# EAGLE schematic arm7-oscilloscope (EAGLE 7.3.0)
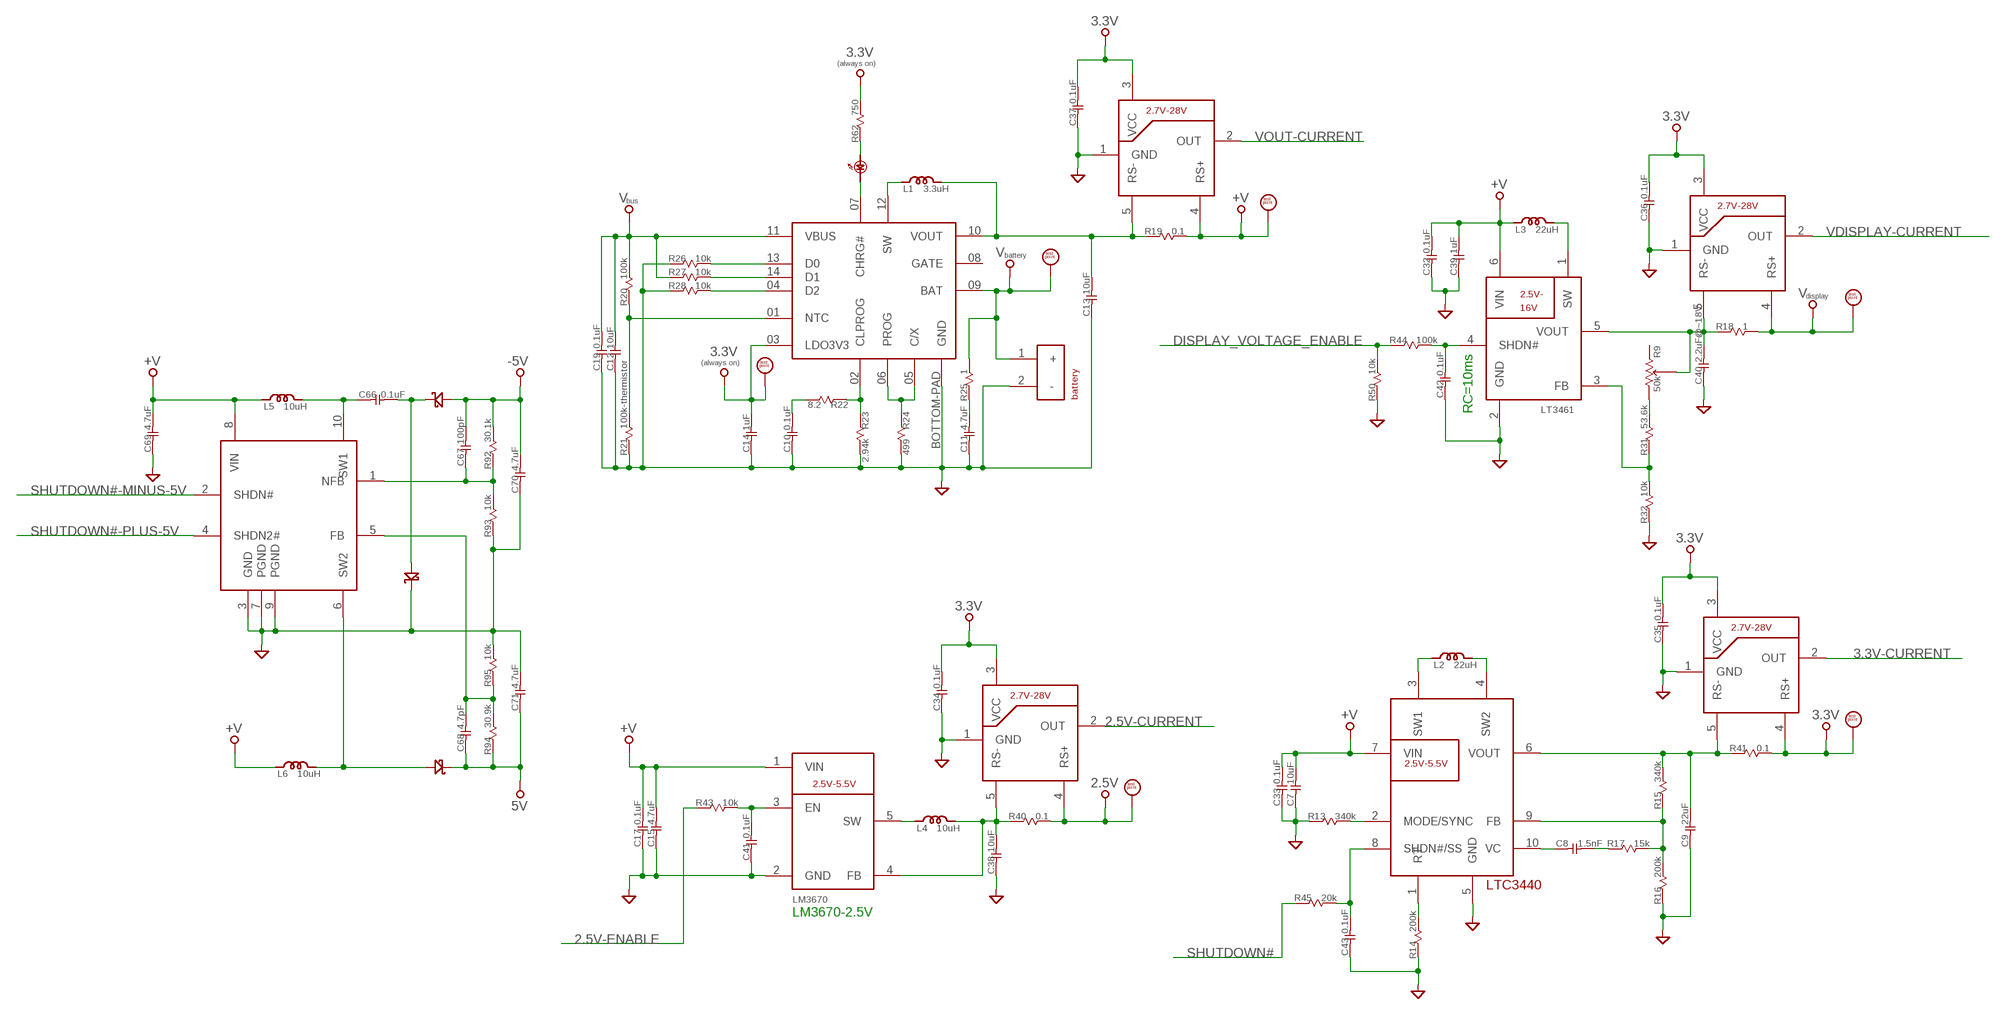
[diagram p0: schematic, sheet 1, part 1 of 3]
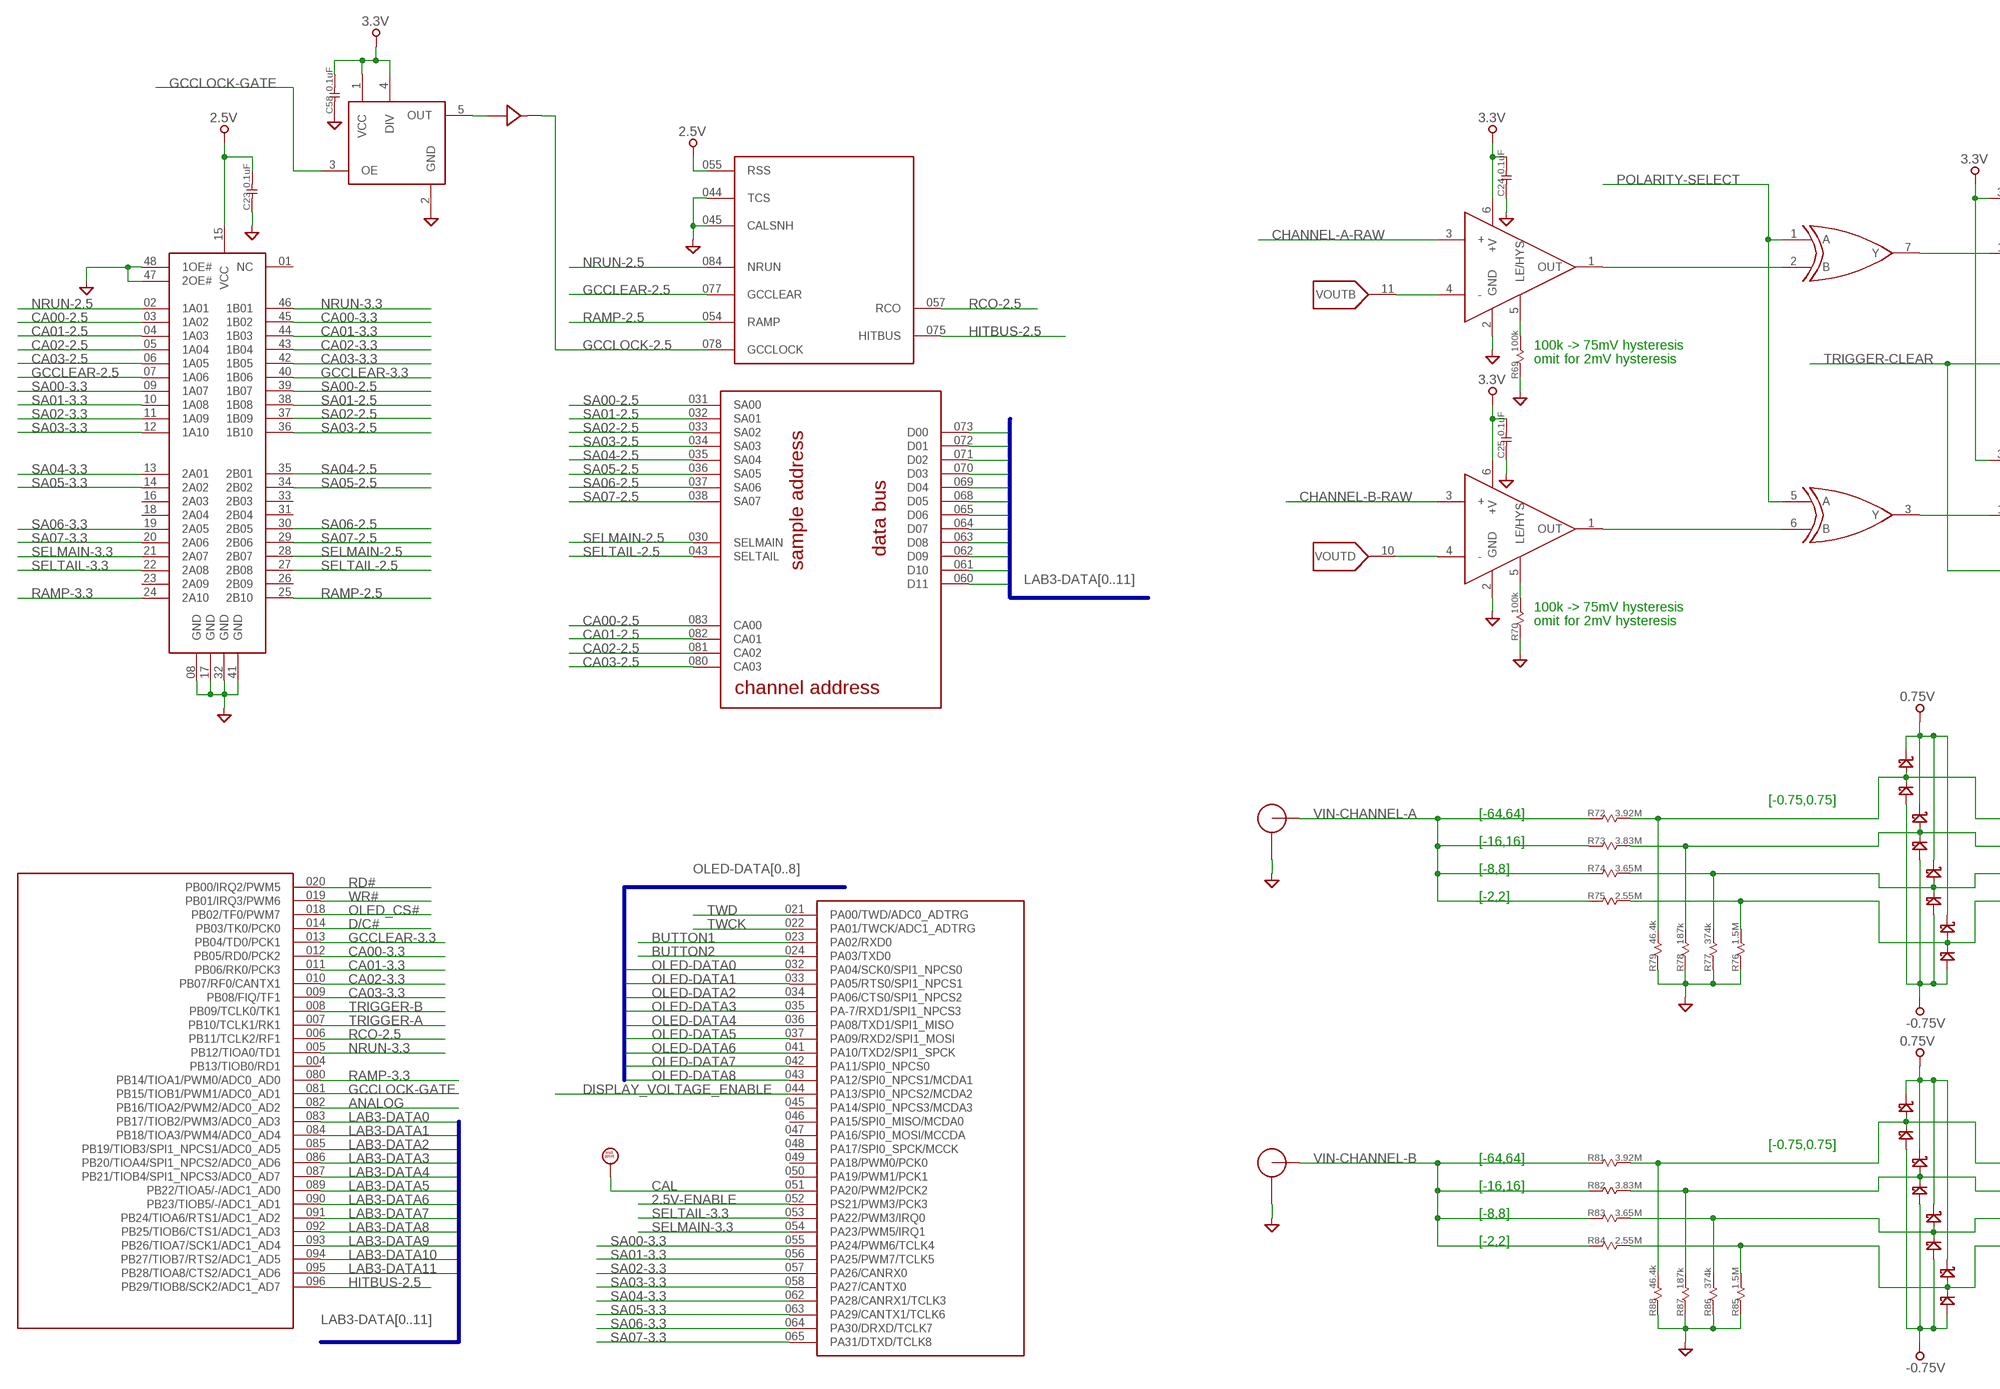
[diagram p1: schematic, sheet 1, part 2 of 3]
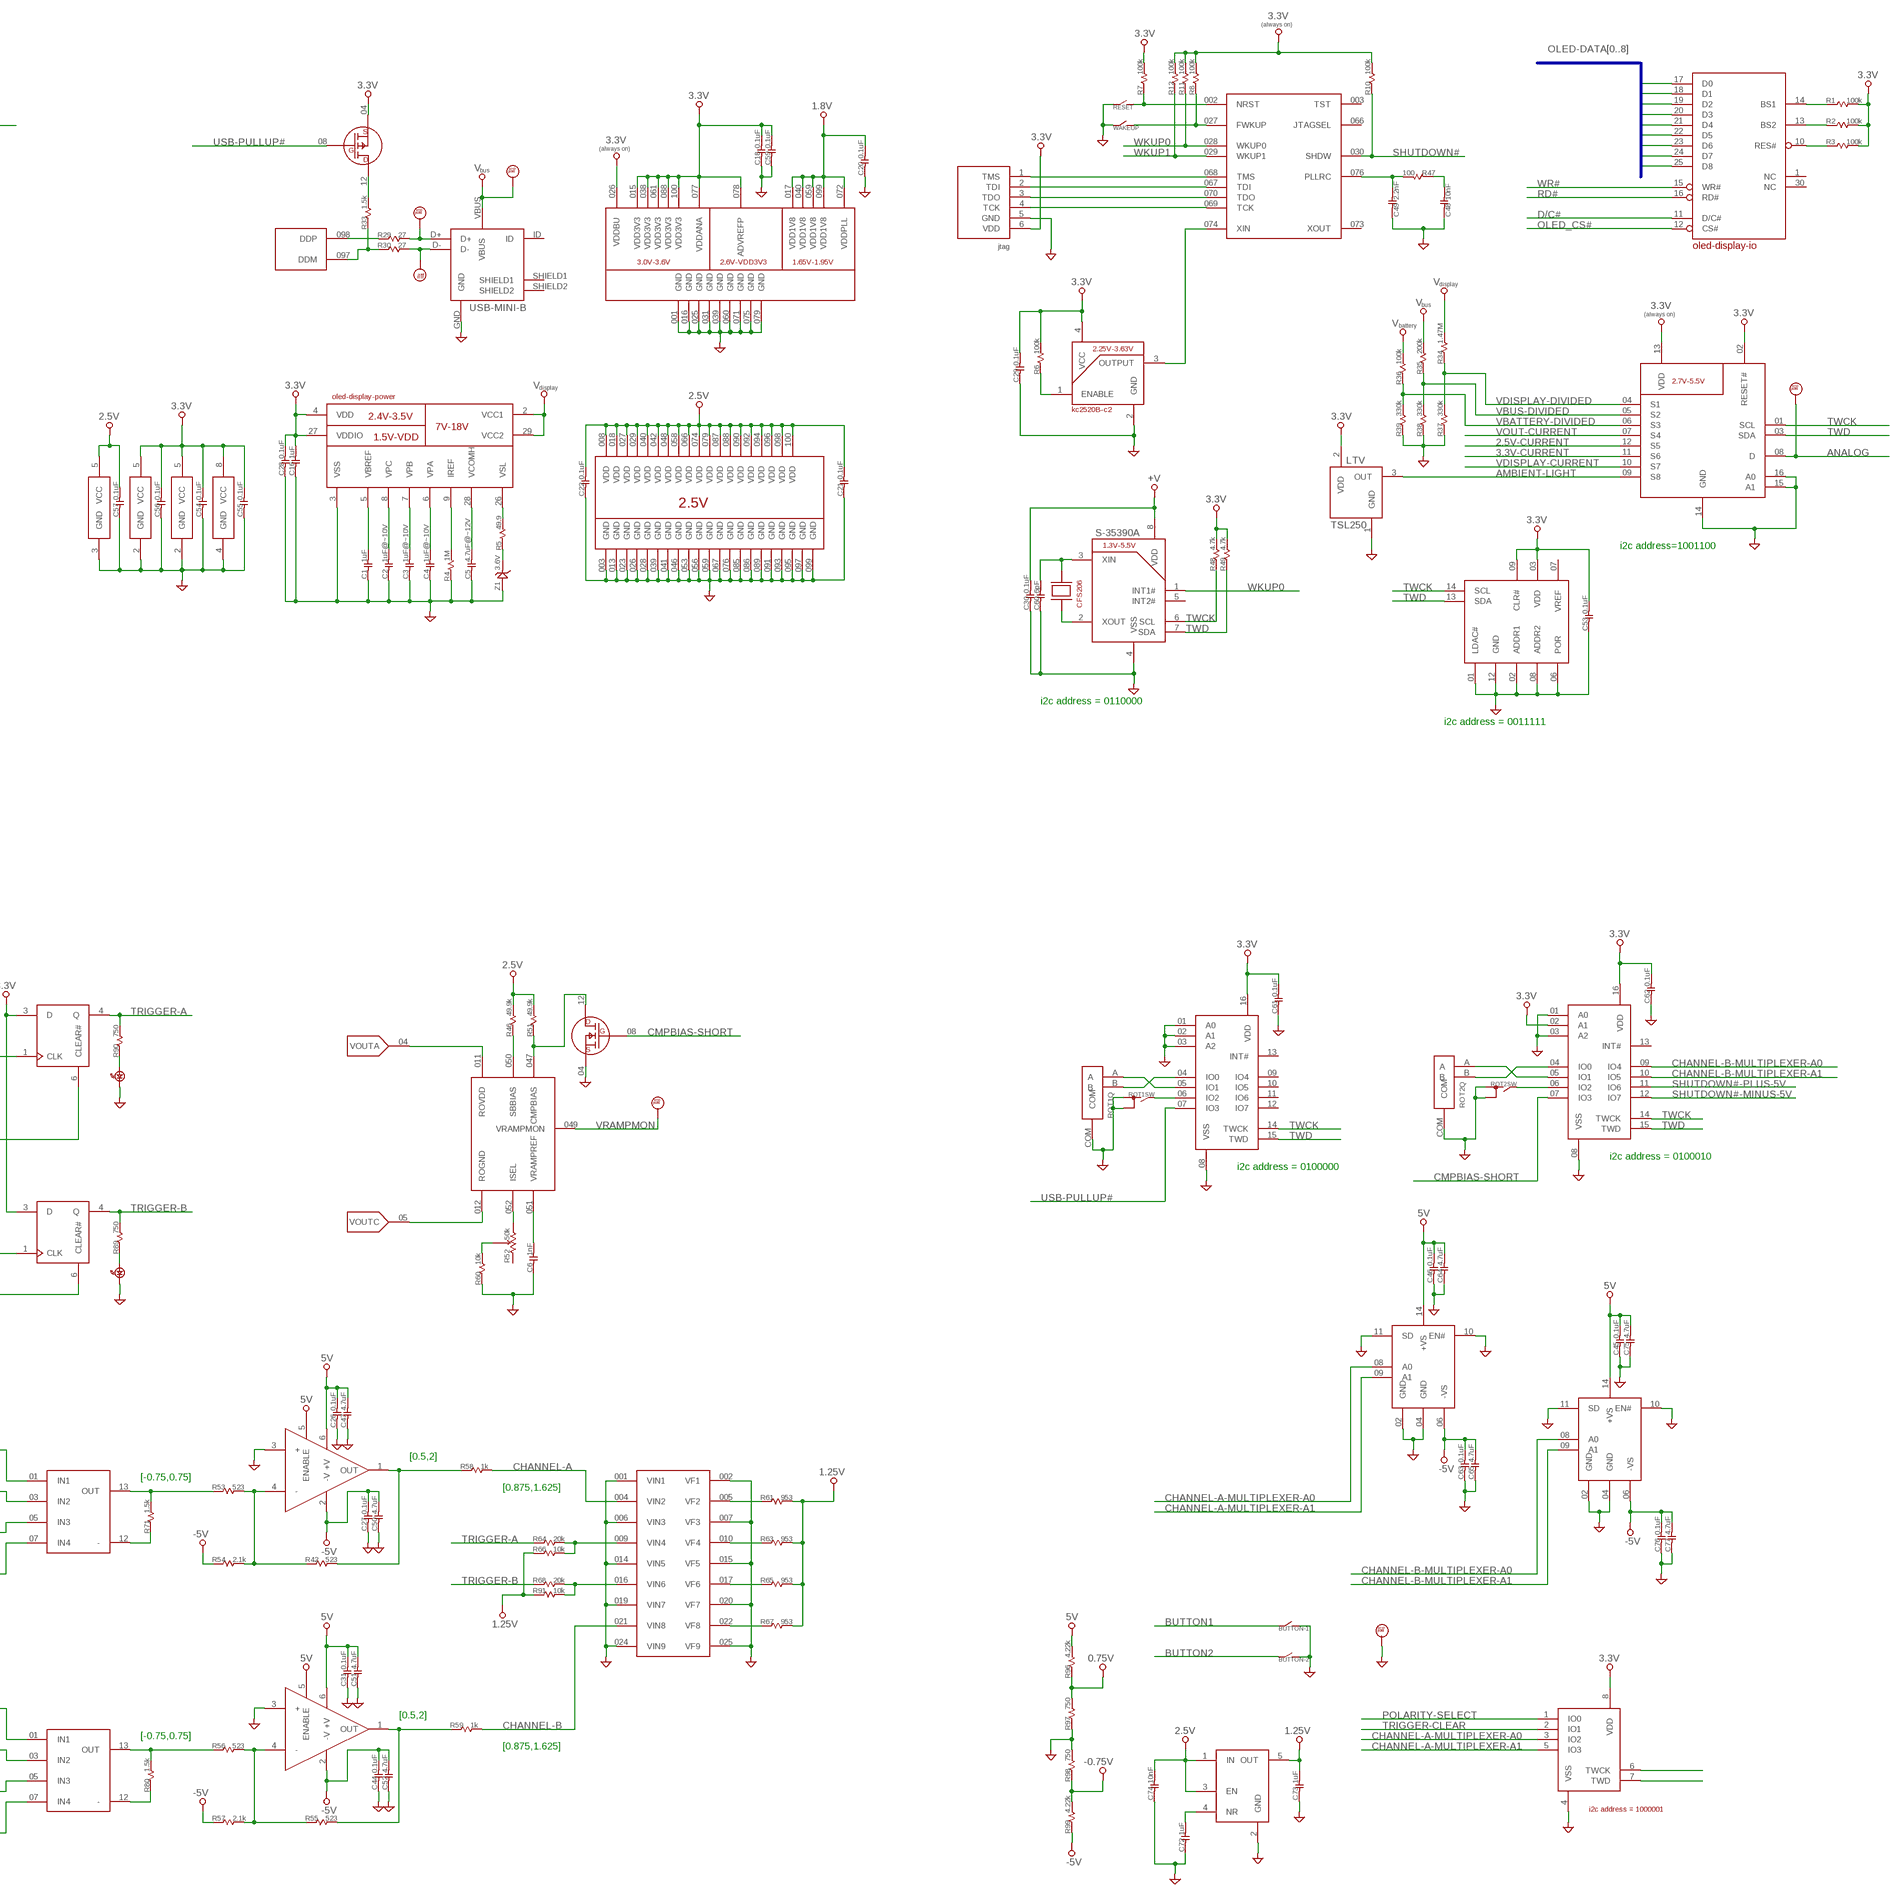
[diagram p2: schematic, sheet 1, part 3 of 3]

## Parts
1.25VDC  TPS731XX  [SOT-23-5]
2.5V  TEST-POINTSURFACE-MOUNT-1X1  [TEST-POINT-SURFACE-MOUNT-1X1]
2.5VDC  LM3670  [SOT-23-5]
3.3V  TEST-POINTSURFACE-MOUNT-1X1  [TEST-POINT-SURFACE-MOUNT-1X1]
3.3V-ALWAYS  TEST-POINTSURFACE-MOUNT-1X1  [TEST-POINT-SURFACE-MOUNT-1X1]
3.3VDC  LTC3440  [MSOP-10]
4DACS  AD56X5R  [TSSOP-14]
7-18VDC  LT3461  [SOT-23-6]
+-5VDC  LT1945  [MSOP-10]
AMP-A  OP-AMP-SOT-23-6  [SOT-23-6]
AMP-B  OP-AMP-SOT-23-6  [SOT-23-6]
ANALOG  TEST-POINTSURFACE-MOUNT-1X1  [TEST-POINT-SURFACE-MOUNT-1X1]
BAT  BATTERY-ON-EXTERNAL-CONNECTOR  [S2B-PH-K]
BUF1  SN74LVC1G34  [SC-70-5]
BUTTON-1  B3U-1000P  [B3U-1000P]
BUTTON-2  B3U-1000P  [B3U-1000P]
C1  1uF  C0603  [0603]
C2  1uF@~10V  C0603  [0603]
C3  1uF@~10V  C0603  [0603]
C4  1uF@~10V  C0603  [0603]
C5  4.7uF@~12V  C0805  [0805]
C6  1nF  C0603  [0603]
C7  10uF  C0805  [0805]
C8  1.5nF  C0603  [0603]
C9  22uF  C0805  [0805]
C10  0.1uF  C0603  [0603]
C11  4.7uF  C0603  [0603]
C12  10uF  C0805  [0805]
C13  10uF  C0805  [0805]
C14  1uF  C0603  [0603]
C15  4.7uF  C0603  [0603]
C16  1uF  C0603  [0603]
C17  0.1uF  C0603  [0603]
C18  0.1uF  C0603  [0603]
C19  0.1uF  C0603  [0603]
C20  0.1uF  C0603  [0603]
C21  0.1uF  C0603  [0603]
C22  0.1uF  C0603  [0603]
C23  0.1uF  C0603  [0603]
C24  0.1uF  C0603  [0603]
C25  0.1uF  C0603  [0603]
C26  0.1uF  C0603  [0603]
C27  0.1uF  C0603  [0603]
C28  0.1uF  C0603  [0603]
C29  0.1uF  C0603  [0603]
C30  0.1uF  C0603  [0603]
C31  0.1uF  C0603  [0603]
C32  0.1uF  C0603  [0603]
C33  0.1uF  C0603  [0603]
C34  0.1uF  C0603  [0603]
C35  0.1uF  C0603  [0603]
C36  0.1uF  C0603  [0603]
C37  0.1uF  C0603  [0603]
C38  10uF  C0603  [0603]
C39  1uF  C0603  [0603]
C40  2.2uF@~18V  C0805  [0805]
C41  0.1uF  C0603  [0603]
C42  0.1uF  C0603  [0603]
C43  0.1uF  C0603  [0603]
C44  0.1uF  C0603  [0603]
C45  0.1uF  C0603  [0603]
C46  0.1uF  C0603  [0603]
C47  4.7uF  C0603  [0603]
C48  10nF  C0603  [0603]
C49  2.2nF  C0603  [0603]
C50  4.7uF  C0603  [0603]
C51  4.7uF  C0603  [0603]
C52  4.7uF  C0603  [0603]
C53  0.1uF  C0603  [0603]
C54  0.1uF  C0603  [0603]
C55  0.1uF  C0603  [0603]
C56  0.1uF  C0603  [0603]
C57  0.1uF  C0603  [0603]
C58  0.1uF  C0603  [0603]
C59  0.1uF  C0603  [0603]
C60  6pF  C0603  [0603]
C61  0.1uF  C0603  [0603]
C62  0.1uF  C0603  [0603]
C63  0.1uF  C0603  [0603]
C64  4.7uF  C0603  [0603]
C65  4.7uF  C0603  [0603]
C66  0.1uF  C0603  [0603]
C67  100pF  C0603  [0603]
C68  4.7pF  C0603  [0603]
C69  4.7uF  C0603  [0603]
C70  4.7uF  C0603  [0603]
C71  4.7uF  C0603  [0603]
C72  1uF  C0603  [0603]
C73  1uF  C0603  [0603]
C74  10nF  C0603  [0603]
C75  4.7uF  C0603  [0603]
C76  0.1uF  C0603  [0603]
C77  4.7uF  C0603  [0603]
CAL  TEST-POINTTHROUGH-HOLE  [TEST-POINT-THROUGH-HOLE]
CH-A  SMA-SHORT-BARREL-SD-73251-115  [SMA-SHORT-BARREL-SD-73251-115]
CH-B  SMA-SHORT-BARREL-SD-73251-115  [SMA-SHORT-BARREL-SD-73251-115]
CHARGE  LED  [0603]
CHRG  LTC4088  [DFN-14]
CMP-A  ADCMP601  [SC-70-6]
CMP-B  ADCMP601  [SC-70-6]
D1  DIODE-SCHOTTKY1005  [1005-DIODE-SCHOTTKY]
D2  DIODE-SCHOTTKY1005  [1005-DIODE-SCHOTTKY]
D3  DIODE-SCHOTTKY1005  [1005-DIODE-SCHOTTKY]
D4  DIODE-SCHOTTKY-PAIR-ANODE-TO-CATHODE  [SOT-23]
D5  DIODE-SCHOTTKY-PAIR-ANODE-TO-CATHODE  [SOT-23]
D6  DIODE-SCHOTTKY-PAIR-ANODE-TO-CATHODE  [SOT-23]
D7  DIODE-SCHOTTKY-PAIR-ANODE-TO-CATHODE  [SOT-23]
D8  DIODE-SCHOTTKY-PAIR-ANODE-TO-CATHODE  [SOT-23]
D9  DIODE-SCHOTTKY-PAIR-ANODE-TO-CATHODE  [SOT-23]
D10  DIODE-SCHOTTKY-PAIR-ANODE-TO-CATHODE  [SOT-23]
D11  DIODE-SCHOTTKY-PAIR-ANODE-TO-CATHODE  [SOT-23]
D+  TEST-POINTSURFACE-MOUNT-1X1  [TEST-POINT-SURFACE-MOUNT-1X1]
D-  TEST-POINTSURFACE-MOUNT-1X1  [TEST-POINT-SURFACE-MOUNT-1X1]
FET1  NDS332P  [SOT-23]
FET2  NDS331N  [SOT-23]
FFA  74LVC1G175  [SC-70-6]
FFB  74LVC1G175  [SC-70-6]
GND  TEST-POINTTHROUGH-HOLE  [TEST-POINT-THROUGH-HOLE]
GPIO1  PCA9536  [MSOP-8-OR-TSSOP-8]
GPIO2  PCA9554  [TSSOP-16]
GPIO3  PCA9554  [TSSOP-16]
JTAG  HEADER-2MM-2X3-JTAG  [HEADER-2MM-2X3]
L1  3.3uH  L  [ELL4-M]
L2  22uH  L  [SD6030]
L3  22uH  L1007  [1007]
L4  10uH  L  [1210]
L5  10uH  L  [1210]
L6  10uH  L  [1210]
LAB3  LABRADOR3  [LQFP-100]
LEVEL-SHIFT  SN74CB3T16210  [TSSOP-48]
LTV  TLS250-BENT  [TSL250-BENT]
MPEX  ADG728  [TSSOP-16]
MPEX-A  FHP3194  [TSSOP-14]
MPEX-B  FHP3194  [TSSOP-14]
OLED  OLED-DISPLAY-CONNECTOR-2TOP-CONTACTS-IN-USE  [XF2M-3015-1A-TOP-CONTACTS-IN-USE]
OSC1  KC2520B-C2  [OSCILLATOR-2.5X2.0]
OSC2  LTC6905  [SOT-23-5]
R1  100k  R0603  [0603]
R2  100k  R0603  [0603]
R3  100k  R0603  [0603]
R4  1M  R0603  [0603]
R5  49.9  R0603  [0603]
R6  100k  R0603  [0603]
R7  100k  R0603  [0603]
R8  100k  R0603  [0603]
R9  50k  3313J-1  [3313J-1]
R10  100k  R0603  [0603]
R11  100k  R0603  [0603]
R12  100k  R0603  [0603]
R13  340k  R0603  [0603]
R14  200k  R0603  [0603]
R15  340k  R0603  [0603]
R16  200k  R0603  [0603]
R17  15k  R0603  [0603]
R18  1  R0805  [0805]
R19  0.1  R0805  [0805]
R20  100k  R0603  [0603]
R21  100k-thermistor  R0603  [0603]
R22  8.2  R0603  [0603]
R23  2.94k  R0603  [0603]
R24  499  R0603  [0603]
R25  1  R0603  [0603]
R26  10k  R0603  [0603]
R27  10k  R0603  [0603]
R28  10k  R0603  [0603]
R29  27  R0603  [0603]
R30  27  R0603  [0603]
R31  53.6k  R0603  [0603]
R32  10k  R0603  [0603]
R33  1.5k  R0603  [0603]
R34  1.47M  R0603  [0603]
R35  200k  R0603  [0603]
R36  100k  R0603  [0603]
R37  330k  R0603  [0603]
R38  330k  R0603  [0603]
R39  330k  R0603  [0603]
R40  0.1  R0805  [0805]
R41  0.1  R0805  [0805]
R42  523  R0603  [0603]
R43  10k  R0603  [0603]
R44  100k  R0603  [0603]
R45  20k  R0603  [0603]
R46  49.9k  R0603  [0603]
R47  100  R0603  [0603]
R48  4.7k  R0603  [0603]
R49  4.7k  R0603  [0603]
R50  10k  R0603  [0603]
R51  49.9k  R0603  [0603]
R52  50k  3313J-1  [3313J-1]
R53  523  R0603  [0603]
R54  2.1k  R0603  [0603]
R55  523  R0603  [0603]
R56  523  R0603  [0603]
R57  2.1k  R0603  [0603]
R58  1k  R0603  [0603]
R59  1k  R0603  [0603]
R60  10k  R0603  [0603]
R61  953  R0603  [0603]
R62  750  R0603  [0603]
R63  953  R0603  [0603]
R64  20k  R0603  [0603]
R65  953  R0603  [0603]
R66  10k  R0603  [0603]
R67  953  R0603  [0603]
R68  20k  R0603  [0603]
R69  100k  R0603  [0603]
R70  100k  R0603  [0603]
R71  1.5k  R0603  [0603]
R72  3.92M  R0603  [0603]
R73  3.83M  R0603  [0603]
R74  3.65M  R0603  [0603]
R75  2.55M  R0603  [0603]
R76  1.5M  R0603  [0603]
R77  374k  R0603  [0603]
R78  187k  R0603  [0603]
R79  46.4k  R0603  [0603]
R80  1.5k  R0603  [0603]
R81  3.92M  R0603  [0603]
R82  3.83M  R0603  [0603]
R83  3.65M  R0603  [0603]
R84  2.55M  R0603  [0603]
R85  1.5M  R0603  [0603]
R86  374k  R0603  [0603]
R87  187k  R0603  [0603]
R88  46.4k  R0603  [0603]
R89  750  R0603  [0603]
R90  750  R0603  [0603]
R91  10k  R0603  [0603]
R92  30.1k  R0603  [0603]
R93  10k  R0603  [0603]
R94  30.9k  R0603  [0603]
R95  10k  R0603  [0603]
R96  4.22k  R0603  [0603]
R97  750  R0603  [0603]
R98  750  R0603  [0603]
R99  4.22k  R0603  [0603]
RESET  B3U-1000P  [B3U-1000P]
ROT1  EVQWK4  [EVQWK4]
ROT2  EVQWK4  [EVQWK4]
RTC  S-35390A  [TSSOP-8]
TRIGGER-A  LED  [0603]
TRIGGER-B  LED  [0603]
U$41  CFS206  [CFS206]
U$69  MAX4372  [SOT-23-5]
U$70  MAX4372  [SOT-23-5]
U$71  MAX4372  [SOT-23-5]
U$72  MAX4372  [SOT-23-5]
UC  AT91SAM7A3  [LQFP-100]
USB  USB-MINI-B  [USB-MINI-B-THROUGH-HOLE]
VBAT  TEST-POINTSURFACE-MOUNT-1X1  [TEST-POINT-SURFACE-MOUNT-1X1]
VBUS  TEST-POINTSURFACE-MOUNT-1X1  [TEST-POINT-SURFACE-MOUNT-1X1]
VDISP  TEST-POINTSURFACE-MOUNT-1X1  [TEST-POINT-SURFACE-MOUNT-1X1]
VOUT  TEST-POINTSURFACE-MOUNT-1X1  [TEST-POINT-SURFACE-MOUNT-1X1]
VRAMP  TEST-POINTSURFACE-MOUNT-1X1  [TEST-POINT-SURFACE-MOUNT-1X1]
WAKEUP  B3U-1000P  [B3U-1000P]
XOR  74LVC2G86  [VSSOP-8]
Z1  3.6V  DIODE-ZENER  [0603]

## Nets
0.75V: D4.04(CATHODE) D5.04(CATHODE) D6.04(CATHODE) D7.04(CATHODE) D8.04(CATHODE) D9.04(CATHODE) D10.04(CATHODE) D11.04(CATHODE) R96.1 R97.2
1.8V: C20.2 UC.017(VDD1V8) UC.040(VDD1V8) UC.059(VDD1V8) UC.072(VDDPLL) UC.099(VDD1V8)
1.25V: 1.25VDC.5(OUT) C73.2 R61.2 R63.2 R65.2 R66.1 R67.2 R91.1
2.5V: 1.25VDC.1(IN) 1.25VDC.3(EN) 2.5V.1 BUF1.5(VCC) C21.2 C22.2 C23.2 C57.2 C74.2 LAB3.008(VDD) LAB3.018(VDD) LAB3.027(VDD) LAB3.029(VDD) LAB3.040(VDD) LAB3.042(VDD) LAB3.048(VDD) LAB3.055(RSS) LAB3.058(VDD) LAB3.066(VDD) LAB3.074(VDD) LAB3.079(VDD) LAB3.087(VDD) LAB3.088(VDD) LAB3.090(VDD) LAB3.092(VDD) LAB3.094(VDD) LAB3.096(VDD) LAB3.098(VDD) LAB3.100(VDD) LEVEL-SHIFT.15(VCC) R40.2 R46.2 R51.2 U$69.4(RS+)
2.5V-CURRENT: MPEX.12(S5) U$69.2(OUT)
2.5V-ENABLE: R43.1 UC.052(PS21/PWM3/PCK3)
3.3V: 3.3V.1 4DACS.03(VDD) 4DACS.09(CLR#) C16.2 C18.2 C24.2 C25.2 C28.2 C29.2 C34.2 C35.2 C36.2 C37.2 C53.2 C54.2 C55.2 C56.2 C58.2 C59.2 C61.2 C62.2 CMP-A.6(+V) CMP-B.6(+V) FET1.04(S) FFA.3(D) FFA.5(VCC) FFB.3(D) FFB.5(VCC) GPIO1.8(VDD) GPIO2.16(VDD) GPIO3.02(A1) GPIO3.16(VDD) JTAG.6(VDD) LTV.2(VDD) MPEX.02(RESET#) OLED.4(VDD) OLED.27(VDDIO) OSC1.4(VCC) OSC2.1(VCC) OSC2.4(DIV) R1.2 R2.2 R3.2 R6.2 R7.2 R41.2 R48.2 R49.2 U$69.3(VCC) U$70.3(VCC) U$70.4(RS+) U$71.3(VCC) U$72.3(VCC) UC.015(VDD3V3) UC.038(VDD3V3) UC.061(VDD3V3) UC.077(VDDANA) UC.078(ADVREFP) UC.088(VDD3V3) UC.100(VDD3V3) XOR.8(VCC)
3.3V-ALWAYS: 3.3V-ALWAYS.1 C14.2 CHRG.03(LDO3V3) MPEX.13(VDD) R8.2 R10.2 R11.2 R12.2 R62.2 UC.026(VDDBU)
3.3V-CURRENT: MPEX.11(S6) U$70.2(OUT)
5V: AMP-A.5(ENABLE) AMP-A.6(+V) AMP-B.5(ENABLE) AMP-B.6(+V) C26.2 C31.2 C45.2 C46.2 C47.2 C51.2 C64.2 C68.1 C71.1 C75.2 D3.P$2(CATHODE) MPEX-A.14(+VS) MPEX-B.14(+VS) R94.1 R96.2
+V: 2.5VDC.1(VIN) 3.3VDC.7(VIN) 7-18VDC.6(VIN) +-5VDC.8(VIN) C7.2 C15.2 C17.2 C30.2 C32.2 C33.2 C39.2 C69.2 L3.1 L5.1 L6.1 R19.2 RTC.8(VDD) U$72.4(RS+) VOUT.1
-0.75V: D4.08(ANODE) D5.08(ANODE) D6.08(ANODE) D7.08(ANODE) D8.08(ANODE) D9.08(ANODE) D10.08(ANODE) D11.08(ANODE) R98.1 R99.2
-5V: AMP-A.2(-V) AMP-B.2(-V) C27.2 C44.2 C50.2 C52.2 C63.2 C65.2 C67.2 C70.2 C76.2 C77.2 D1.P$1(ANODE) MPEX-A.06(-VS) MPEX-B.06(-VS) R54.1 R57.1 R92.2 R99.1
AMBIENT-LIGHT: LTV.3(OUT) MPEX.09(S8)
ANALOG: ANALOG.1 MPEX.08(D) UC.082(PB16/TIOA2/PWM2/ADC0_AD2)
BUTTON1: BUTTON-1.1 UC.023(PA02/RXD0)
BUTTON2: BUTTON-2.1 UC.024(PA03/TXD0)
CA00-2.5: LAB3.083(CA00) LEVEL-SHIFT.03(1A02)
CA00-3.3: LEVEL-SHIFT.45(1B02) UC.012(PB05/RD0/PCK2)
CA01-2.5: LAB3.082(CA01) LEVEL-SHIFT.04(1A03)
CA01-3.3: LEVEL-SHIFT.44(1B03) UC.011(PB06/RK0/PCK3)
CA02-2.5: LAB3.081(CA02) LEVEL-SHIFT.05(1A04)
CA02-3.3: LEVEL-SHIFT.43(1B04) UC.010(PB07/RF0/CANTX1)
CA03-2.5: LAB3.080(CA03) LEVEL-SHIFT.06(1A05)
CA03-3.3: LEVEL-SHIFT.42(1B05) UC.009(PB08/FIQ/TF1)
CAL: CAL.1 UC.051(PA20/PWM2/PCK2)
CHANNEL-A: LAB3.004(VIN2) R58.2
CHANNEL-A-MULTIPLEXER-A0: GPIO1.3(IO2) MPEX-A.08(A0)
CHANNEL-A-MULTIPLEXER-A1: GPIO1.5(IO3) MPEX-A.09(A1)
CHANNEL-A-RAW: AMP-A.1(OUT) CMP-A.3(+) R42.2 R58.1
CHANNEL-B: LAB3.021(VIN8) R59.2
CHANNEL-B-MULTIPLEXER-A0: GPIO3.09(IO4) MPEX-B.08(A0)
CHANNEL-B-MULTIPLEXER-A1: GPIO3.10(IO5) MPEX-B.09(A1)
CHANNEL-B-RAW: AMP-B.1(OUT) CMP-B.3(+) R55.2 R59.1
CHRG: CHARGE.C CHRG.07(CHRG#)
CMPBIAS-SHORT: FET2.08(G) GPIO3.07(IO3)
D/C#: OLED.11(D/C#) UC.014(PB03/TK0/PCK0)
DISPLAY_VOLTAGE_ENABLE: R44.1 R50.2 UC.044(PA13/SPI0_NPCS2/MCDA2)
GCCLEAR-2.5: LAB3.077(GCCLEAR) LEVEL-SHIFT.07(1A06)
GCCLEAR-3.3: LEVEL-SHIFT.40(1B06) UC.013(PB04/TD0/PCK1)
GCCLOCK-2.5: BUF1.4(OUT) LAB3.078(GCCLOCK)
GCCLOCK-GATE: OSC2.3(OE) UC.081(PB15/TIOB1/PWM1/ADC0_AD1)
GND: 1.25VDC.2(GND) 2.5VDC.2(GND) 3.3VDC.5(GND) 4DACS.01(LDAC#) 4DACS.02(ADDR1) 4DACS.06(POR) 4DACS.08(ADDR2) 4DACS.12(GND) 7-18VDC.2(GND) +-5VDC.3(GND) +-5VDC.7(PGND) +-5VDC.9(PGND) AMP-A.3(+) AMP-B.3(+) BAT.2(-) BUF1.3(GND) BUTTON-1.2 BUTTON-2.2 C1.1 C2.1 C3.1 C4.1 C5.1 C6.1 C7.1 C9.1 C10.1 C11.1 C12.1 C13.1 C14.1 C15.1 C16.1 C17.1 C18.1 C19.1 C20.1 C21.1 C22.1 C23.1 C24.1 C25.1 C26.1 C27.1 C28.1 C29.1 C30.1 C31.1 C32.1 C33.1 C34.1 C35.1 C36.1 C37.1 C38.1 C39.1 C40.1 C41.1 C42.1 C43.1 C44.1 C45.1 C46.1 C47.1 C48.1 C49.1 C50.1 C51.1 C52.1 C53.1 C54.1 C55.1 C56.1 C57.1 C58.1 C59.1 C60.1 C61.1 C62.1 C63.1 C64.1 C65.1 C69.1 C70.1 C71.2 C72.1 C73.1 C74.1 C75.1 C76.1 C77.1 CH-A.GND@1(GND) CH-B.GND@1(GND) CHRG.BOTTOM-PAD(GND) CMP-A.2(GND) CMP-B.2(GND) D2.P$2(CATHODE) FET2.04(S) FFA.2(GND) FFB.2(GND) GND.1 GPIO1.4(VSS) GPIO2.01(A0) GPIO2.02(A1) GPIO2.03(A2) GPIO2.08(VSS) GPIO3.01(A0) GPIO3.03(A2) GPIO3.08(VSS) JTAG.5(GND) LAB3.001(VIN1) LAB3.002(VF1) LAB3.003(GND) LAB3.006(VIN3) LAB3.007(VF3) LAB3.013(GND) LAB3.014(VIN5) LAB3.015(VF5) LAB3.019(VIN7) LAB3.020(VF7) LAB3.023(GND) LAB3.024(VIN9) LAB3.025(VF9) LAB3.026(GND) LAB3.028(GND) LAB3.039(GND) LAB3.041(GND) LAB3.044(TCS) LAB3.045(CALSNH) LAB3.046(GND) LAB3.053(GND) LAB3.056(GND) LAB3.059(GND) LAB3.067(GND) LAB3.076(GND) LAB3.085(GND) LAB3.086(GND) LAB3.089(GND) LAB3.091(GND) LAB3.093(GND) LAB3.095(GND) LAB3.097(GND) LAB3.099(GND) LEVEL-SHIFT.08(GND) LEVEL-SHIFT.17(GND) LEVEL-SHIFT.32(GND) LEVEL-SHIFT.41(GND) LEVEL-SHIFT.47(2OE#) LEVEL-SHIFT.48(1OE#) LTV.1(GND) MPEX-A.02(GND) MPEX-A.04(GND) MPEX-A.10(EN#) MPEX-A.11(SD) MPEX-B.02(GND) MPEX-B.04(GND) MPEX-B.10(EN#) MPEX-B.11(SD) MPEX.14(GND) MPEX.15(A1) MPEX.16(A0) OLED.3(VSS) OSC1.2(GND) OSC2.2(GND) R4.1 R13.1 R14.1 R16.1 R21.1 R23.2 R24.2 R26.1 R28.1 R32.1 R37.1 R38.1 R39.1 R50.1 R60.1 R69.1 R70.1 R76.1 R77.1 R78.1 R79.1 R85.1 R86.1 R87.1 R88.1 R93.1 R95.2 R97.1 R98.2 RESET.1 ROT1.COM(Q:COM) ROT1.SW1@3(SW:2A) ROT1.SW1@5(SW:2B) ROT2.COM(Q:COM) ROT2.SW1@3(SW:2A) ROT2.SW1@5(SW:2B) RTC.4(VSS) TRIGGER-A.C TRIGGER-B.C U$69.1(GND) U$70.1(GND) U$71.1(GND) U$72.1(GND) UC.001(GND) UC.016(GND) UC.025(GND) UC.031(GND) UC.039(GND) UC.060(GND) UC.071(GND) UC.075(GND) UC.079(GND) USB.GND WAKEUP.1 XOR.4(GND) Z1.1
HITBUS-2.5: LAB3.075(HITBUS) UC.096(PB29/TIOB8/SCK2/ADC1_AD7)
LAB3-DATA0: LAB3.073(D00) UC.083(PB17/TIOB2/PWM3/ADC0_AD3)
LAB3-DATA1: LAB3.072(D01) UC.084(PB18/TIOA3/PWM4/ADC0_AD4)
LAB3-DATA2: LAB3.071(D02) UC.085(PB19/TIOB3/SPI1_NPCS1/ADC0_AD5)
LAB3-DATA3: LAB3.070(D03) UC.086(PB20/TIOA4/SPI1_NPCS2/ADC0_AD6)
LAB3-DATA4: LAB3.069(D04) UC.087(PB21/TIOB4/SPI1_NPCS3/ADC0_AD7)
LAB3-DATA5: LAB3.068(D05) UC.089(PB22/TIOA5/-/ADC1_AD0)
LAB3-DATA6: LAB3.065(D06) UC.090(PB23/TIOB5/-/ADC1_AD1)
LAB3-DATA7: LAB3.064(D07) UC.091(PB24/TIOA6/RTS1/ADC1_AD2)
LAB3-DATA8: LAB3.063(D08) UC.092(PB25/TIOB6/CTS1/ADC1_AD3)
LAB3-DATA9: LAB3.062(D09) UC.093(PB26/TIOA7/SCK1/ADC1_AD4)
LAB3-DATA10: LAB3.061(D10) UC.094(PB27/TIOB7/RTS2/ADC1_AD5)
LAB3-DATA11: LAB3.060(D11) UC.095(PB28/TIOA8/CTS2/ADC1_AD6)
LTC4088-D0: CHRG.13(D0) R26.2
LTC4088-D1: CHRG.14(D1) R27.2
LTC4088-D2: CHRG.04(D2) R28.2
MAIN_OSCILLATOR: OSC1.3(OUTPUT) UC.074(XIN)
N$1: R7.1 RESET.2 UC.002(NRST)
N$2: R8.1 UC.027(FWKUP) WAKEUP.2
N$3: +-5VDC.1(NFB) C67.1 R92.1 R93.2
N$4: 4DACS.11(VOUTB) CMP-A.4(-)
N$5: R52.1-CCW R60.2
N$7: CHARGE.A R62.1
N$8: BUF1.2(IN) OSC2.5(OUT)
N$9: OLED.14(BS1) R1.1
N$12: 1.25VDC.4(NR) C72.2
N$13: LAB3.016(VIN6) R68.2 R91.2
N$14: LAB3.009(VIN4) R64.2 R66.2
N$15: GPIO2.04(IO0) ROT1.B(Q:B)
N$16: GPIO2.05(IO1) ROT1.A(Q:A)
N$17: GPIO2.06(IO2) ROT1.SW2
N$18: +-5VDC.5(FB) C68.2 R94.2 R95.1
N$19: GPIO3.06(IO2) ROT2.SW2
N$20: GPIO3.04(IO0) ROT2.B(Q:B)
N$21: GPIO3.05(IO1) ROT2.A(Q:A)
N$22: +-5VDC.6(SW2) D3.P$1(ANODE) L6.2
N$26: 3.3VDC.2(MODE/SYNC) R13.2
N$27: 3.3VDC.3(SW1) L2.1
N$28: 3.3VDC.1(RT) R14.2
N$29: 3.3VDC.4(SW2) L2.2
N$30: C8.2 R17.1
N$31: OLED.13(BS2) R2.1
N$32: OLED.10(RES#) R3.1
N$33: +-5VDC.10(SW1) C66.1 L5.2
N$34: C1.2 OLED.5(VBREF)
N$35: C2.2 OLED.8(VPC)
N$36: C3.2 OLED.7(VPB)
N$37: C4.2 OLED.6(VPA)
N$38: OLED.9(IREF) R4.2
N$39: C5.2 OLED.28(VCOMH)
N$40: OLED.26(VSL) R5.2
N$41: R5.1 Z1.2
N$42: C66.2 D1.P$2(CATHODE) D2.P$1(ANODE)
N$45: 3.3VDC.10(VC) C8.1
N$46: OSC1.1(ENABLE) R6.1
N$48: FET1.12(D) R33.2
N$49: LAB3.052(ISEL) R52.3-CW
N$50: 3.3VDC.9(FB) R15.1 R16.2 R17.2
N$51: 2.5VDC.4(FB) C38.2 L4.2 R40.1 U$69.5(RS-)
N$52: C60.2 RTC.3(XIN) U$41.P$1
N$53: RTC.2(XOUT) U$41.P$2
N$54: 7-18VDC.1(SW) L3.2
N$55: LAB3.050(SBBIAS) R46.1
N$56: 7-18VDC.3(FB) R31.1 R32.2
N$57: FET2.12(D) LAB3.047(CMPBIAS) R51.1
N$58: C6.2 LAB3.051(VRAMPREF)
N$59: 4DACS.04(VOUTA) LAB3.011(ROVDD)
N$61: CHRG.01(NTC) R20.1 R21.2
N$62: CHRG.12(SW) L1.1
N$63: 4DACS.05(VOUTC) LAB3.012(ROGND)
N$65: C10.2 R22.2
N$66: CHRG.02(CLPROG) R22.1 R23.1
N$67: CHRG.05(C/X) CHRG.06(PROG) R24.1
N$68: C49.2 R47.2 UC.076(PLLRC)
N$69: C11.2 R25.1
N$70: CMP-A.1(OUT) XOR.2(B)
N$71: C48.2 R47.1
N$72: D+.1 R29.2 USB.D+
N$73: D-.1 R30.2 USB.D-
N$74: R29.1 UC.098(DDP)
N$75: R30.1 R33.1 UC.097(DDM)
N$76: JTAG.1(TMS) UC.068(TMS)
N$77: JTAG.2(TDI) UC.067(TDI)
N$79: JTAG.3(TDO) UC.070(TDO)
N$80: 3.3VDC.6(VOUT) C9.2 R15.2 R41.1 U$70.5(RS-)
N$81: JTAG.4(TCK) UC.069(TCK)
N$82: 2.5VDC.3(EN) C41.2 R43.2
N$83: R9.3-CW R31.2
N$84: 7-18VDC.4(SHDN#) C42.2 R44.2
N$85: 3.3VDC.8(SHDN#/SS) C43.2 R45.2
N$88: FFA.1(CLK) XOR.7(Y)
N$89: FFB.1(CLK) XOR.3(Y)
N$90: CMP-B.1(OUT) XOR.6(B)
N$92: AMP-A.4(-) R42.1 R53.2 R54.2
N$94: AMP-B.4(-) R55.1 R56.2 R57.2
N$96: 4DACS.10(VOUTD) CMP-B.4(-)
N$97: LAB3.005(VF2) R61.1
N$99: LAB3.010(VF4) R63.1
N$101: LAB3.017(VF6) R65.1
N$103: LAB3.022(VF8) R67.1
N$105: CMP-A.5(LE/HYS) R69.2
N$106: CMP-B.5(LE/HYS) R70.2
N$109: MPEX-A.13(OUT) R53.1 R71.2
N$110: MPEX-A.12(-) R71.1
N$111: D4.12(ANODE-CATHODE) MPEX-A.01(IN1) R72.2 R79.2
N$113: D6.12(ANODE-CATHODE) MPEX-A.05(IN3) R74.2 R77.2
N$114: D7.12(ANODE-CATHODE) MPEX-A.07(IN4) R75.2 R76.2
N$116: MPEX-B.13(OUT) R56.1 R80.2
N$117: MPEX-B.12(-) R80.1
N$118: D8.12(ANODE-CATHODE) MPEX-B.01(IN1) R81.2 R88.2
N$119: D9.12(ANODE-CATHODE) MPEX-B.03(IN2) R82.2 R87.2
N$120: D10.12(ANODE-CATHODE) MPEX-B.05(IN3) R83.2 R86.2
N$121: D11.12(ANODE-CATHODE) MPEX-B.07(IN4) R84.2 R85.2
N$125: R90.1 TRIGGER-A.A
N$126: 2.5VDC.5(SW) L4.1
N$127: R89.1 TRIGGER-B.A
N$1234: D5.12(ANODE-CATHODE) MPEX-A.03(IN2) R73.2 R78.2
NRUN-2.5: LAB3.084(NRUN) LEVEL-SHIFT.02(1A01)
NRUN-3.3: LEVEL-SHIFT.46(1B01) UC.005(PB12/TIOA0/TD1)
OLED-DATA0: OLED.17(D0) UC.032(PA04/SCK0/SPI1_NPCS0)
OLED-DATA1: OLED.18(D1) UC.033(PA05/RTS0/SPI1_NPCS1)
OLED-DATA2: OLED.19(D2) UC.034(PA06/CTS0/SPI1_NPCS2)
OLED-DATA3: OLED.20(D3) UC.035(PA-7/RXD1/SPI1_NPCS3)
OLED-DATA4: OLED.21(D4) UC.036(PA08/TXD1/SPI1_MISO)
OLED-DATA5: OLED.22(D5) UC.037(PA09/RXD2/SPI1_MOSI)
OLED-DATA6: OLED.23(D6) UC.041(PA10/TXD2/SPI1_SPCK)
OLED-DATA7: OLED.24(D7) UC.042(PA11/SPI0_NPCS0)
OLED-DATA8: OLED.25(D8) UC.043(PA12/SPI0_NPCS1/MCDA1)
OLED_CS#: OLED.12(CS#) UC.018(PB02/TF0/PWM7)
POLARITY-SELECT: GPIO1.1(IO0) XOR.1(A) XOR.5(A)
RAMP-2.5: LAB3.054(RAMP) LEVEL-SHIFT.25(2B10)
RAMP-3.3: LEVEL-SHIFT.24(2A10) UC.080(PB14/TIOA1/PWM0/ADC0_AD0)
RCO-2.5: LAB3.057(RCO) UC.006(PB11/TCLK2/RF1)
RD#: OLED.16(RD#) UC.020(PB00/IRQ2/PWM5)
SA00-2.5: LAB3.031(SA00) LEVEL-SHIFT.39(1B07)
SA00-3.3: LEVEL-SHIFT.09(1A07) UC.055(PA24/PWM6/TCLK4)
SA01-2.5: LAB3.032(SA01) LEVEL-SHIFT.38(1B08)
SA01-3.3: LEVEL-SHIFT.10(1A08) UC.056(PA25/PWM7/TCLK5)
SA02-2.5: LAB3.033(SA02) LEVEL-SHIFT.37(1B09)
SA02-3.3: LEVEL-SHIFT.11(1A09) UC.057(PA26/CANRX0)
SA03-2.5: LAB3.034(SA03) LEVEL-SHIFT.36(1B10)
SA03-3.3: LEVEL-SHIFT.12(1A10) UC.058(PA27/CANTX0)
SA04-2.5: LAB3.035(SA04) LEVEL-SHIFT.35(2B01)
SA04-3.3: LEVEL-SHIFT.13(2A01) UC.062(PA28/CANRX1/TCLK3)
SA05-2.5: LAB3.036(SA05) LEVEL-SHIFT.34(2B02)
SA05-3.3: LEVEL-SHIFT.14(2A02) UC.063(PA29/CANTX1/TCLK6)
SA06-2.5: LAB3.037(SA06) LEVEL-SHIFT.30(2B05)
SA06-3.3: LEVEL-SHIFT.19(2A05) UC.064(PA30/DRXD/TCLK7)
SA07-2.5: LAB3.038(SA07) LEVEL-SHIFT.29(2B06)
SA07-3.3: LEVEL-SHIFT.20(2A06) UC.065(PA31/DTXD/TCLK8)
SELMAIN-2.5: LAB3.030(SELMAIN) LEVEL-SHIFT.28(2B07)
SELMAIN-3.3: LEVEL-SHIFT.21(2A07) UC.054(PA23/PWM5/IRQ1)
SELTAIL-2.5: LAB3.043(SELTAIL) LEVEL-SHIFT.27(2B08)
SELTAIL-3.3: LEVEL-SHIFT.22(2A08) UC.053(PA22/PWM3/IRQ0)
SHUTDOWN#: R10.1 R45.1 UC.030(SHDW)
SHUTDOWN#-MINUS-5V: +-5VDC.2(SHDN#) GPIO3.12(IO7)
SHUTDOWN#-PLUS-5V: +-5VDC.4(SHDN2#) GPIO3.11(IO6)
TRIGGER-A: FFA.4(Q) R64.1 R90.2 UC.007(PB10/TCLK1/RK1)
TRIGGER-B: FFB.4(Q) R68.1 R89.2 UC.008(PB09/TCLK0/TK1)
TRIGGER-CLEAR: FFA.6(CLEAR#) FFB.6(CLEAR#) GPIO1.2(IO1)
TWCK: 4DACS.14(SCL) GPIO1.6(TWCK) GPIO2.14(TWCK) GPIO3.14(TWCK) MPEX.01(SCL) R48.1 RTC.6(SCL) UC.022(PA01/TWCK/ADC1_ADTRG)
TWD: 4DACS.13(SDA) GPIO1.7(TWD) GPIO2.15(TWD) GPIO3.15(TWD) MPEX.03(SDA) R49.1 RTC.7(SDA) UC.021(PA00/TWD/ADC0_ADTRG)
USB-PULLUP#: FET1.08(G) GPIO2.07(IO3)
VBAT: C13.2 CHRG.10(VOUT) L1.2 R19.1 U$72.5(RS-)
VBATTERY: BAT.1(+) CHRG.09(BAT) R25.2 R36.2 VBAT.1
VBATTERY-DIVIDED: MPEX.06(S3) R36.1 R39.2
VBUS: C12.2 C19.2 CHRG.11(VBUS) R20.2 R27.1 R35.2 USB.VBUS VBUS.1
VBUS-DIVIDED: MPEX.05(S2) R35.1 R38.2
VDISPLAY: OLED.2(VCC1) OLED.29(VCC2) R18.2 R34.2 U$71.4(RS+) VDISP.1
VDISPLAY-CURRENT: MPEX.10(S7) U$71.2(OUT)
VDISPLAY-DIVIDED: MPEX.04(S1) R34.1 R37.2
VDISPLAY-PRIME: 7-18VDC.5(VOUT) C40.2 R9.1-CCW R18.1 U$71.5(RS-)
VIN-CHANNEL-A: CH-A.SIGNAL R72.1 R73.1 R74.1 R75.1
VIN-CHANNEL-B: CH-B.SIGNAL R81.1 R82.1 R83.1 R84.1
VOUT-CURRENT: MPEX.07(S4) U$72.2(OUT)
VRAMPMON: LAB3.049(VRAMPMON) VRAMP.1
WKUP0: R11.1 RTC.1(INT1#) UC.028(WKUP0)
WKUP1: R12.1 UC.029(WKUP1)
WR#: OLED.15(WR#) UC.019(PB01/IRQ3/PWM6)
Unconnected: CHRG.08(GATE) GPIO2.09(IO4) GPIO2.10(IO5) GPIO2.11(IO6) GPIO2.12(IO7) GPIO2.13(INT#) GPIO3.13(INT#) LEVEL-SHIFT.01(NC) LEVEL-SHIFT.16(2A03) LEVEL-SHIFT.18(2A04) LEVEL-SHIFT.23(2A09) LEVEL-SHIFT.26(2B09) LEVEL-SHIFT.31(2B04) LEVEL-SHIFT.33(2B03) OLED.1(NC) OLED.30(NC) R9.2-WIPER R52.2-WIPER ROT1.P$1(SHIELD1) ROT1.P$2(SHIELD2) ROT1.P$3(SHIELD3) ROT1.P$5(SHIELD4) ROT2.P$1(SHIELD1) ROT2.P$2(SHIELD2) ROT2.P$3(SHIELD3) ROT2.P$5(SHIELD4) RTC.5(INT2#) UC.003(TST) UC.004(PB13/TIOB0/RD1) UC.045(PA14/SPI0_NPCS3/MCDA3) UC.046(PA15/SPI0_MISO/MCDA0) UC.047(PA16/SPI0_MOSI/MCCDA) UC.048(PA17/SPI0_SPCK/MCCK) UC.049(PA18/PWM0/PCK0) UC.050(PA19/PWM1/PCK1) UC.066(JTAGSEL) UC.073(XOUT) USB.ID USB.SHIELD1 USB.SHIELD2

## Buses
OLED-DATA[0..8]
LAB3-DATA[0..11]

## Notes on the sheet
- RC=10ms
- i2c address=1001100
- LM3670-2.5V
- i2c address = 0110000
- i2c address = 0011111
- 100k -> 75mV hysteresis
- omit for 2mV hysteresis
- i2c address = 0100010
- i2c address = 0100000
- 100k -> 75mV hysteresis
- omit for 2mV hysteresis
- [0.5,2]
- [-0.75,0.75]
- [-64,64] | [-0.75,0.75]
- [0.875,1.625]
- [-16,16]
- [-8,8]
- [-2,2]
- [0.5,2]
- [-0.75,0.75]
- [-64,64] | [-0.75,0.75]
- [0.875,1.625]
- [-16,16]
- [-8,8]
- [-2,2]

## Power pins joined to a net without a drawn wire
GND: CH-A.GND@2(GND) CH-A.GND@3(GND) CH-A.GND@4(GND) CH-B.GND@2(GND) CH-B.GND@3(GND) CH-B.GND@4(GND)
VREF: 4DACS.07(VREF)

## Library data of the parts
1.25VDC = mza-texas-instruments-voltage-regulators:TPS731XX
2.5V 3.3V 3.3V-ALWAYS ANALOG CAL D+ D- GND VBAT VBUS VDISP VOUT VRAMP = mza-test-points:TEST-POINT
2.5VDC = mza-national-semiconductor-voltage-regulators:LM3670
3.3VDC = mza-linear-technology-voltage-regulators:LTC3440
4DACS = mza-analog-devices-dacs:AD56X5R
7-18VDC = mza-linear-technology-voltage-regulators:LT3461
+-5VDC = mza-linear-technology-voltage-regulators:LT1945
AMP-A AMP-B = mza-operational-amplifiers:OP-AMP-SOT-23-6
BAT = mza-jst-through-hole-connectors:BATTERY-ON-EXTERNAL-CONNECTOR
BUF1 = mza-texas-instruments-logic:SN74LVC1G34
BUTTON-1 BUTTON-2 RESET WAKEUP = mza-discrete-components-surface-mount:B3U-1000P
C1-C77 = mza-discrete-components-surface-mount:C*: a capacitor
CH-A CH-B = mza-molex-connectors:SMA-SHORT-BARREL-SD-73251-115
CHARGE TRIGGER-A TRIGGER-B = mza-osram-leds:LED
CHRG = mza-linear-technology-voltage-regulators:LTC4088
CMP-A CMP-B = mza-analog-devices-comparators:ADCMP601
D1-D3 = mza-discrete-components-surface-mount:DIODE-SCHOTTKY
D4-D11 = mza-diodes:DIODE-SCHOTTKY-PAIR-ANODE-TO-CATHODE
FET1 = mza-fairchild-fets:NDS332P
FET2 = mza-fairchild-fets:NDS331N
FFA FFB = mza-texas-instruments-logic:74LVC1G175
GPIO1 = mza-nxp-i2c-gpio-extenders:PCA9536
GPIO2 GPIO3 = mza-nxp-i2c-gpio-extenders:PCA9554
JTAG = mza-through-hole-connectors:HEADER-2MM-2X3-JTAG
L1 = mza-panasonic-inductors:L*
L2 = mza-coiltronics-inductors:L*
L3 = mza-taiyo-yuden-inductors:L*
L4-L6 = mza-tdk-inductors:L*: an 0805 inductor
LAB3 = mza-UH-IDL:LABRADOR3
LEVEL-SHIFT = mza-texas-instruments-voltage-level-translators:SN74CB3T16210
LTV = mza-discrete-components-through-hole:TLS250-BENT: light meter
MPEX = mza-analog-devices-multiplexers:ADG728
MPEX-A MPEX-B = mza-fairchild-multiplexers:FHP3194
OLED = mza-omron-connectors:OLED-DISPLAY-CONNECTOR-2
OSC1 = mza-kyocera-oscillators:KC2520B-C2
OSC2 = mza-linear-oscillators:LTC6905
R1-R8 R10-R51 R53-R99 = mza-discrete-components-surface-mount:R*: a resistor
R9 R52 = mza-bourns-potentiometers:3313J-1
ROT1 ROT2 = mza-panasonic-rotary-encoders:EVQWK4
RTC = mza-seiko-rtcs:S-35390A
U$41 = mza-citizen-crystals:CFS206
U$69-U$72 = mza-maxim-amplifiers:MAX4372
UC = mza-atmel-microcontrollers:AT91SAM7A3
USB = mza-molex-connectors:USB-MINI-B: mini usb b connector
XOR = mza-texas-instruments-logic:74LVC2G86
Z1 = mza-discrete-components-surface-mount:DIODE-ZENER